# EAGLE schematic Arduino 40hz audio and led (EAGLE 9.2.2)
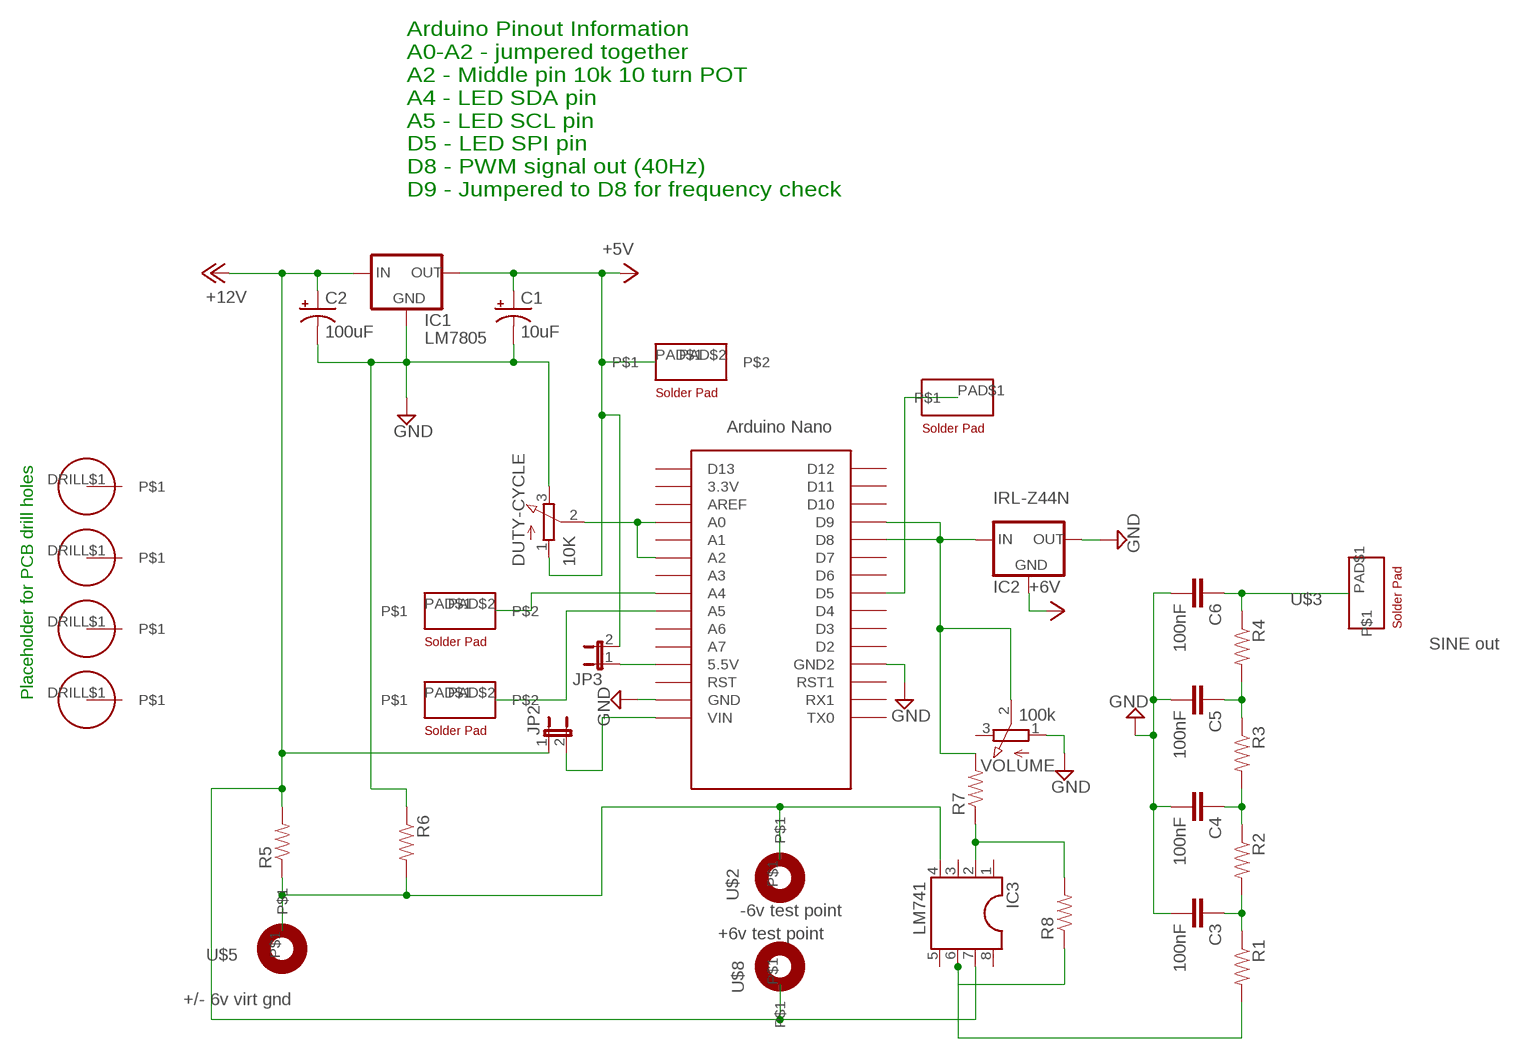
[diagram p0: schematic, sheet 1]

## Parts
C1  10uF  CAP-POLARIZED-RADIAL-2.5MM-25V-20%  [CAP-POLARIZED]
C2  100uF  CAP-POLARIZED-RADIAL-2.5MM-25V-20%  [CAP-POLARIZED]
C3  100nF  CAP-MEDIUM-MUPPET  [CAP-MEDIUM-MUPPET]
C4  100nF  CAP-MEDIUM-MUPPET  [CAP-MEDIUM-MUPPET]
C5  100nF  CAP-MEDIUM-MUPPET  [CAP-MEDIUM-MUPPET]
C6  100nF  CAP-MEDIUM-MUPPET  [CAP-MEDIUM-MUPPET]
DUTY-CYCLE  10K  POTENTIOMETER  [POTENTIOMETER]
IC1  LM7805  V_REG_78XXSIDE  [78XXL]
IC2  IRL-Z44N  V_REG_78XXSIDE  [78XXL]
IC3  LM741  DUAL-INLINE-8DIL08-2  [DIL08]
JP2  JUMPER-JP1E  [JP1]
JP3  JUMPER-JP1E  [JP1]
P+1  +12V  [POWER-IN-PAD]
P+2  +5V  [POWER-IN-PAD]
P+3  +6V  [POWER-IN-PAD]
R1  RESISTORPTH-1/4W  [AXIAL-0.4]
R2  RESISTORPTH-1/4W  [AXIAL-0.4]
R3  RESISTORPTH-1/4W  [AXIAL-0.4]
R4  RESISTORPTH-1/4W  [AXIAL-0.4]
R5  RESISTORPTH-1/4W  [AXIAL-0.4]
R6  RESISTORPTH-1/4W  [AXIAL-0.4]
R7  RESISTORPTH-1/4W  [AXIAL-0.4]
R8  RESISTORPTH-1/4W  [AXIAL-0.4]
U$1  ARDUINO-NANO  [ARDUINO-NANO]
U$2  -6v test point  PROBE-POINTPROBE_POINT_1  [PROBE_POINT_1]
U$3  SINE out  PAD-1PIN-RECTANGLE  [PAD-1PIN-RECTANGLE-125MIL]
U$4  PAD-2PIN-RECTANGLE  [PAD-2PIN-RECTANGLE-50MIL]
U$5  +/- 6v virt gnd  PROBE-POINTPROBE_POINT_1  [PROBE_POINT_1]
U$6  PAD-2PIN-RECTANGLE  [PAD-2PIN-RECTANGLE-50MIL]
U$7  PAD-2PIN-RECTANGLE  [PAD-2PIN-RECTANGLE-50MIL]
U$8  +6v test point  PROBE-POINTPROBE_POINT_1  [PROBE_POINT_1]
U$9  PAD-1PIN-RECTANGLE  [PAD-1PIN-RECTANGLE-125MIL]
U$10  DRILL-HOLE-4MM  [DRILL-HOLE-4MM]
U$11  DRILL-HOLE-4MM  [DRILL-HOLE-4MM]
U$12  DRILL-HOLE-4MM  [DRILL-HOLE-4MM]
U$13  DRILL-HOLE-4MM  [DRILL-HOLE-4MM]
VOLUME  100k  POTENTIOMETER  [POTENTIOMETER]

## Nets
+5V: C1.1(+) DUTY-CYCLE.1(A) IC1.OUT IC2.GND JP3.2 P+2.VCC(+5V) P+3.VCC(+5V) U$7.PAD$1
+12V: C2.1(+) IC1.IN IC3.7 JP2.1 P+1.VCC(+12V) R5.P$2 U$8.P$1
GND: C1.2(-) C2.2(-) C3.2 C4.2 C5.2 C6.2 DUTY-CYCLE.3(E) IC1.GND IC2.OUT R6.P$1 U$1.GND U$1.GND1(GND2) VOLUME.1(A)
N$1: DUTY-CYCLE.2(S) U$1.A0 U$1.A2
N$2: IC2.IN R7.P$2 U$1.D8 U$1.D9 VOLUME.2(S)
N$3: C3.1 R1.P$1 R2.P$2
N$4: C4.1 R2.P$1 R3.P$2
N$5: C5.1 R3.P$1 R4.P$2
N$6: C6.1 R4.P$1
N$8: JP2.2 U$1.RAW(VIN)
N$9: JP3.1 U$1.5V(5.5V)
N$10: IC3.2 R7.P$1 R8.P$2
N$11: U$1.D5 U$9.PAD$1
N$12: IC3.4 R5.P$1 R6.P$2 U$2.P$1 U$5.P$1
N$13: IC3.6 R1.P$2 R8.P$1
N$14: U$1.A4 U$4.PAD$2
N$15: U$1.A5 U$6.PAD$2
Unconnected: IC3.1 IC3.3 IC3.5 IC3.8 U$1.3.3V U$1.A1 U$1.A3 U$1.A6 U$1.A7 U$1.AREF U$1.D2 U$1.D3 U$1.D4 U$1.D6 U$1.D7 U$1.D10 U$1.D11 U$1.D12 U$1.D13 U$1.RST U$1.RST1 U$1.RX1 U$1.TX0 U$3.PAD$1 U$4.PAD$1 U$6.PAD$1 U$7.PAD$2 U$10.DRILL$1 U$11.DRILL$1 U$12.DRILL$1 U$13.DRILL$1 VOLUME.3(E)

## Notes on the sheet
- Arduino Pinout Information
  A0-A2 - jumpered together
  A2 - Middle pin 10k 10 turn POT
  A4 - LED SDA pin
  A5 - LED SCL pin
  D5 - LED SPI pin
  D8 - PWM signal out (40Hz)
  D9 - Jumpered to D8 for frequency check
- Placeholder for PCB drill holes

## Library data of the parts
C1 = jim_muppet_parts:CAP-POLARIZED: 100µF polarized capacitors A capacitor is a passive two-terminal electrical component used to store electrical energy temporarily in an electric field.; PROD_ID: CAP-08439; VALUE: 100uF
C2 = jim_muppet_parts:CAP-POLARIZED: 100µF polarized capacitors A capacitor is a passive two-terminal electrical component used to store electrical energy temporarily in an electric field.; PROD_ID: CAP-08439
C3-C6 = jim_muppet_parts:CAP-MEDIUM-MUPPET: Capacitor - Muppet style - Medium size SMT Pads 120 square SMT pads; PROD_ID: JIM-CAP Large SMT; VALUE: Set 0.0uF
DUTY-CYCLE VOLUME = jim_muppet_parts:POTENTIOMETER: 16mm Potentiometer one level Source: http://www.alphapotentiometers.net/html/16mm_pot_2.html
IC1 IC2 = jim_muppet_parts:V_REG_78XX: Voltage Regulator Standard 7805 5V regulator. IGO (Input Ground Output). Spark Fun Electronics SKU : COM-00107
IC3 = jim_muppet_parts:DUAL-INLINE-8: Dual In Line / Socket
JP2 JP3 = jim_muppet_parts:JUMPER-JP1E: JUMPER
P+1 = jim_muppet_parts:+12V: SUPPLY SYMBOL
P+2 = jim_muppet_parts:+5V: SUPPLY SYMBOL
P+3 = jim_muppet_parts:+6V: SUPPLY SYMBOL
R1-R8 = jim_muppet_parts:RESISTOR: Resistor Basic schematic elements and footprints for 0603, 1206, and PTH resistors.
U$1 = jim_muppet_parts:ARDUINO-NANO: Arduino Nano
U$2 U$5 U$8 = jim_muppet_parts:PROBE-POINT
U$3 U$9 = jim_muppet_parts:PAD-1PIN-RECTANGLE: 3 Pin - Rounded Rectangle Solder Pad 125MIL
U$4 U$6 U$7 = jim_muppet_parts:PAD-2PIN-RECTANGLE: 3 Pin - Rounded Rectangle Solder Pad 50MIL 100MIL 150MIL 200MIL
U$10-U$13 = jim_muppet_parts:DRILL-HOLE-4MM: Marker for where to put drill holes

## Net classes
0 default: width 0.914 mm, clearance 0.762 mm
1 Thin20: width 0.508 mm, clearance 0.508 mm
2 Medium25: width 0.635 mm, clearance 0.635 mm
3 Medium30: width 0.762 mm, clearance 0.762 mm
4 Large50: width 1.27 mm, clearance 0.762 mm
5 Large100: width 2.54 mm, clearance 0.762 mm